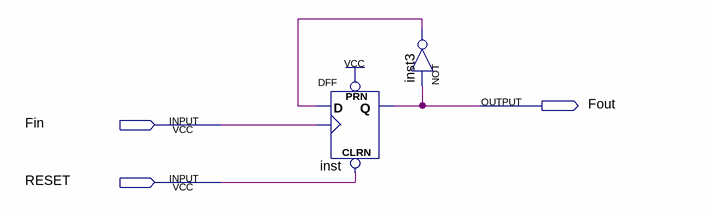
[diagram p0: schematic sheet]
// Quartus schematic frequency_divider_1to2.bdf as structural Verilog: 2 symbols, 3 pins
module frequency_divider_1to2 (
  input  Fin,
  input  RESET,
  output Fout
);

  wire inst3_out;

  DFF inst (.CLRN(RESET), .CLK(Fin), .D(inst3_out), .PRN(1'b1), .Q(Fout));
  not inst3 (inst3_out, Fout);
endmodule
